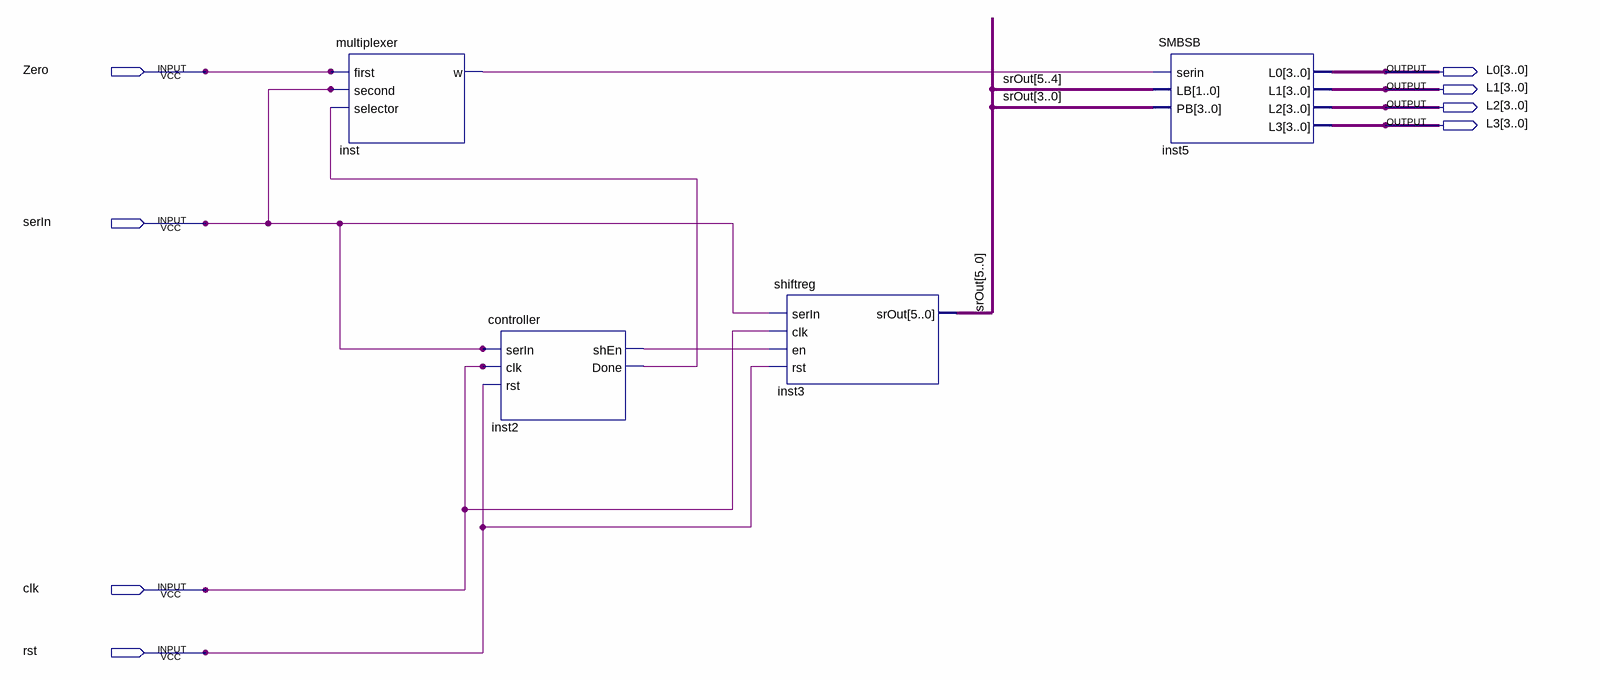
[diagram p0: schematic sheet]
// Quartus schematic CA4.bdf as structural Verilog: 4 symbols, 8 pins
module CA4 (
  input  Zero,
  input  serIn,
  input  clk,
  input  rst,
  output [3:0] L0,
  output [3:0] L1,
  output [3:0] L2,
  output [3:0] L3
);

  wire inst2_done, inst2_shen, inst_w;
  wire [5:0] srOut;

  multiplexer inst (.first(Zero), .second(serIn), .selector(inst2_done), .w(inst_w));
  controller inst2 (.serIn(serIn), .clk(clk), .rst(rst), .shEn(inst2_shen), .Done(inst2_done));
  shiftreg inst3 (.serIn(serIn), .clk(clk), .en(inst2_shen), .rst(rst), .srOut(srOut));
  SMBSB inst5 (.serin(inst_w), .LB(srOut[5:4]), .PB(srOut[3:0]), .L0(L0), .L1(L1), .L2(L2), .L3(L3));
endmodule
